# Altium schematic sheet Hekr V1.1.SchDoc
size A3
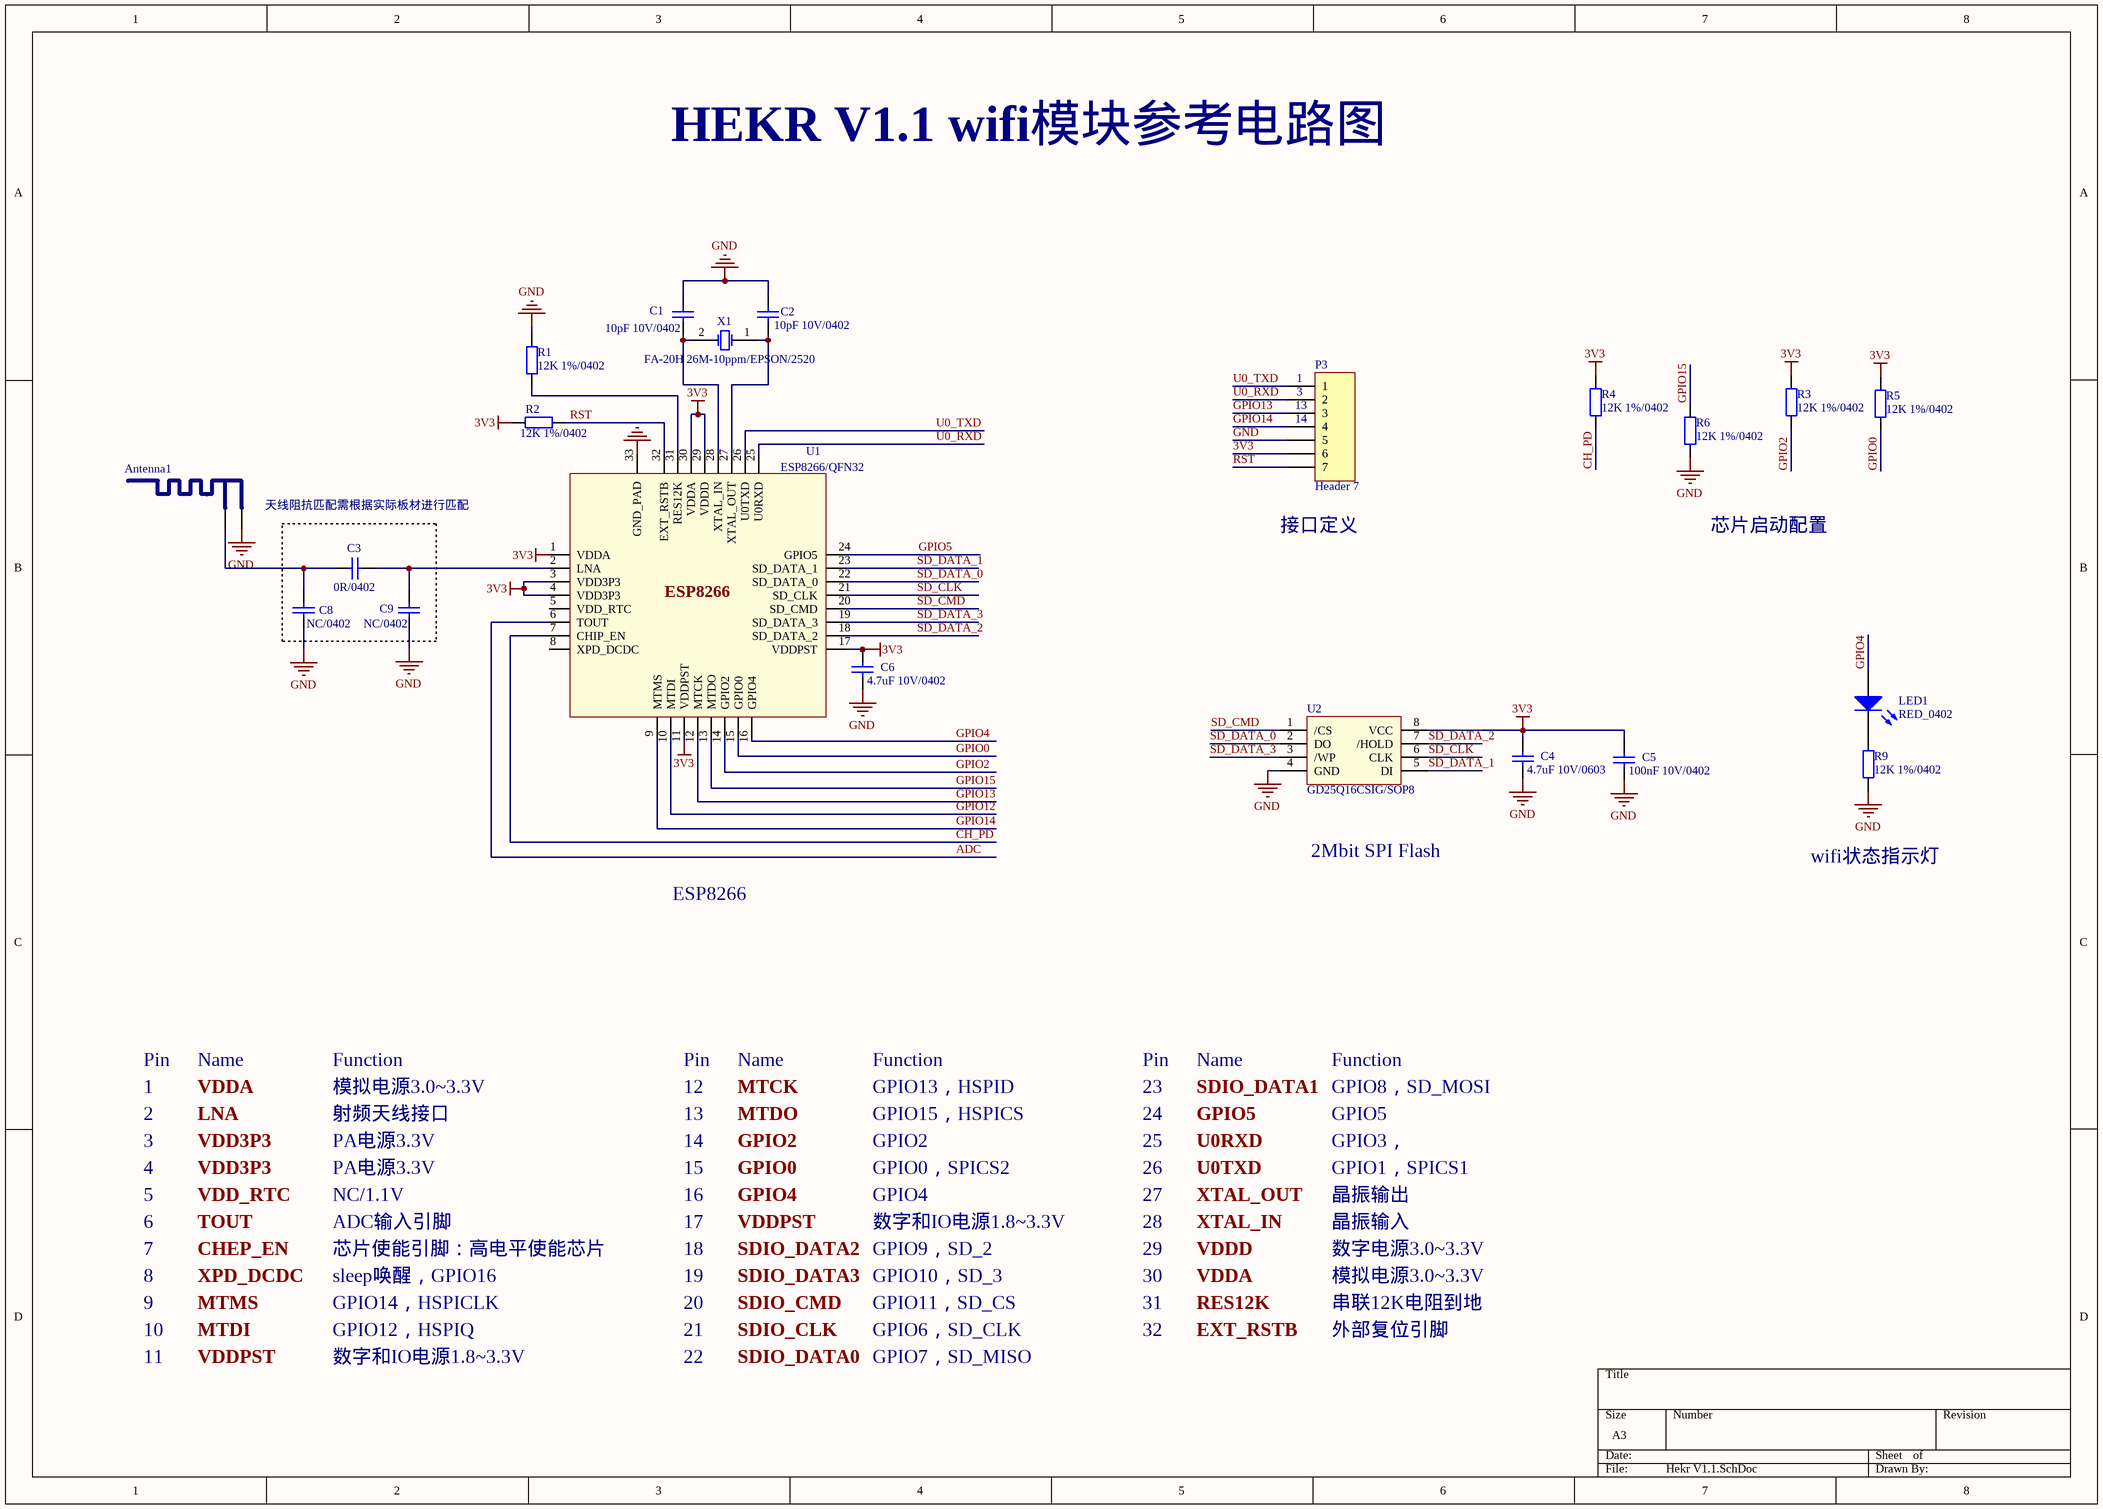
[diagram p0: Hekr V1.1.SchDoc]

## Parts
Antenna1  F Antenna  [2.4G_ANTENNA_2]  (value not drawn)
C1  10pF 10V/0402  [C_0402]
C2  10pF 10V/0402  [C_0402]
C3  0R/0402  [C_0402]
C4  4.7uF 10V/0603  [C_0805]
C5  100nF 10V/0402  [C_0402]
C6  4.7uF 10V/0402  [C_0402]
C8  NC/0402  [C_0402]
C9  NC/0402  [C_0402]
LED1  RED_0402  [LED_0402]
P3  Header 7  [DIP6-2.0]
R1  value 12K 1%/0402  [R_0402]  (hidden comment: 12K/0402)
R2  value 12K 1%/0402  [R_0402]  (hidden comment: 4.7K/0402)
R3  value 12K 1%/0402  [R_0402]  (hidden comment: 4.7K/0402)
R4  value 12K 1%/0402  [R_0402]  (hidden comment: 4.7K/0402)
R5  value 12K 1%/0402  [R_0402]  (hidden comment: 4.7K/0402)
R6  value 12K 1%/0402  [R_0402]  (hidden comment: 4.7K/0402)
R9  value 12K 1%/0402  [R_0402]  (hidden comment: 1K/0402)
U1  ESP8266/QFN32  [ESP8266]
U2  GD25Q16CSIG/SOP8  [GD25Q16/64]
X1  FA-20H 26M-10ppm/EPSON/2520  [XTAL_2520]

## Nets
3V3: C4.2 C5.2 C6.2 P3.6 R2.2 R3.2 R4.2 R5.2 U1.1(VDDA) U1.3(VDD3P3) U1.4(VDD3P3) U1.11(VDDPST) U1.17(VDDPST) U1.29(VDDD) U1.30(VDDA) U2.8(VCC)
GND: Antenna1.2 C1.2 C2.2 C4.1 C5.1 C6.1 C8.1 C9.1 P3.5 R1.2 R6.1 R9.1 U1.33(GND_PAD) U2.4(GND)
ADC: U1.6(TOUT)
CH_PD: R4.1 U1.7(CHIP_EN)
GPIO0: R5.1 U1.15(GPIO0)
GPIO2: R3.1 U1.14(GPIO2)
GPIO4: LED1.1(A) U1.16(GPIO4)
GPIO5: U1.24(GPIO5)
GPIO12: U1.10(MTDI)
GPIO13: P3.3 U1.12(MTCK)
GPIO14: P3.4 U1.9(MTMS)
GPIO15: R6.2 U1.13(MTDO)
RST: P3.7 R2.1 U1.32(EXT_RSTB)
SD_CLK: U1.21(SD_CLK) U2.6(CLK)
SD_CMD: U1.20(SD_CMD) U2.1(/CS)
SD_DATA_0: U1.22(SD_DATA_0) U2.2(DO)
SD_DATA_1: U1.23(SD_DATA_1) U2.5(DI)
SD_DATA_2: U1.18(SD_DATA_2) U2.7(/HOLD)
SD_DATA_3: U1.19(SD_DATA_3) U2.3(/WP)
U0_RXD: P3.2 U1.25(U0RXD)
U0_TXD: P3.1 U1.26(U0TXD)
NetAntenna1_1: Antenna1.1 C3.1 C8.2
NetC1_1: C1.1 U1.28(XTAL_IN) X1.2(OSC2)
NetC2_1: C2.1 U1.27(XTAL_OUT) X1.1(OSC1)
NetC3_2: C3.2 C9.2 U1.2(LNA)
NetLED1_2: LED1.2(K) R9.2
NetR1_1: R1.1 U1.31(RES12K)

Not connected (* = marked no-connect by the designer): U1 5(VDD_RTC) 8(XPD_DCDC)

## Notes on the sheet
- HEKR V1.1 wifi模块参考电路图
- (near P3) 1
- (near P3) 13
- (near P3) 14
- (near P3) 3
- (near Antenna1) 天线阻抗匹配需根据实际板材进行匹配
- (near P3) 接口定义
- 芯片启动配置
- 2Mbit SPI Flash
- ESP8266
- wifi状态指示灯
- Pin
- 1
- 2
- Name
- VDDA
- LNA
- Function
- 模拟电源3.0~3.3V
- 射频天线接口
- 12
- 13
- MTCK
- MTDO
- GPIO13，HSPID
- GPIO15，HSPICS
- 23
- 24
- SDIO_DATA1
- GPIO5
- GPIO8，SD_MOSI
- 3
- 4
- VDD3P3
- PA电源3.3V
- 14
- 15
- GPIO2
- GPIO0
- GPIO0，SPICS2
- 25
- 26
- U0RXD
- U0TXD
- GPIO3，
- GPIO1，SPICS1
- 5
- 6
- 7
- VDD_RTC
- TOUT
- CHEP_EN
- NC/1.1V
- ADC输入引脚
- 芯片使能引脚：高电平使能芯片
- 16
- 17
- 18
- GPIO4
- VDDPST
- SDIO_DATA2
- 数字和IO电源1.8~3.3V
- GPIO9，SD_2
- 27
- 28
- 29
- XTAL_OUT
- XTAL_IN
- VDDD
- 晶振输出
- 晶振输入
- 数字电源3.0~3.3V
- 8
- 9
- XPD_DCDC
- MTMS
- sleep唤醒，GPIO16
- GPIO14，HSPICLK
- 19
- 20
- SDIO_DATA3
- SDIO_CMD
- GPIO10，SD_3
- GPIO11，SD_CS
- 30
- 31
- RES12K
- 串联12K电阻到地
- 10
- 11
- MTDI
- GPIO12，HSPIQ
- 21
- 22
- SDIO_CLK
- SDIO_DATA0
- GPIO6，SD_CLK
- GPIO7，SD_MISO
- 32
- EXT_RSTB
- 外部复位引脚
- (in symbol ESP8266/QFN32) ESP8266

## Library data of the parts
C1-C6 C8 C9 = C0603: Value: 100p; Published: 8-Jun-2000; LatestRevisionDate: 17-Jul-2002; LatestRevisionNote: Re-released for DXP Platform.; PackageReference: RAD-0.3; Publisher: Altium Limited; PackageDescription: Radial Cap, Thru-Hole; 2 Leads; 0.3 in Pin Spacing
LED1 = LED2: Typical RED, GREEN, YELLOW, AMBER GaAs LED; Published: 8-Jun-2000; LatestRevisionDate: 17-Jul-2002; LatestRevisionNote: Re-released for DXP Platform.; PackageDocument: Feb-2002; PackageReference: 3.2X1.6X1.1; Publisher: Altium Limited
P3 = Header 7: Header, 7-Pin; LatestRevisionDate: 17-Jul-2002; LatestRevisionNote: Re-released for DXP Platform.; Publisher: Altium Limited
R1-R6 R9 = Res2: Resistor; Published: 8-Jun-2000; LatestRevisionDate: 17-Jul-2002; LatestRevisionNote: Re-released for DXP Platform.; PackageReference: AXIAL-0.4; Publisher: Altium Limited; PackageDescription: Axial Device, Thru-Hole; 2 Leads; 0.4 in Pin Spacing
U2 = GD25Q64BSIG
X1 = XTAL: Crystal Oscillator; Published: 8-Jun-2000; LatestRevisionDate: 17-Jul-2002; LatestRevisionNote: Re-released for DXP Platform.; PackageReference: R38; Publisher: Altium Limited; PackageDescription: Crystal, Thru-Hole; 2 Leads; Body 3.1 x 8.2 mm (Dia.xH)